# Altium project SahinbeyTeam Motor Driver.PrjPcb
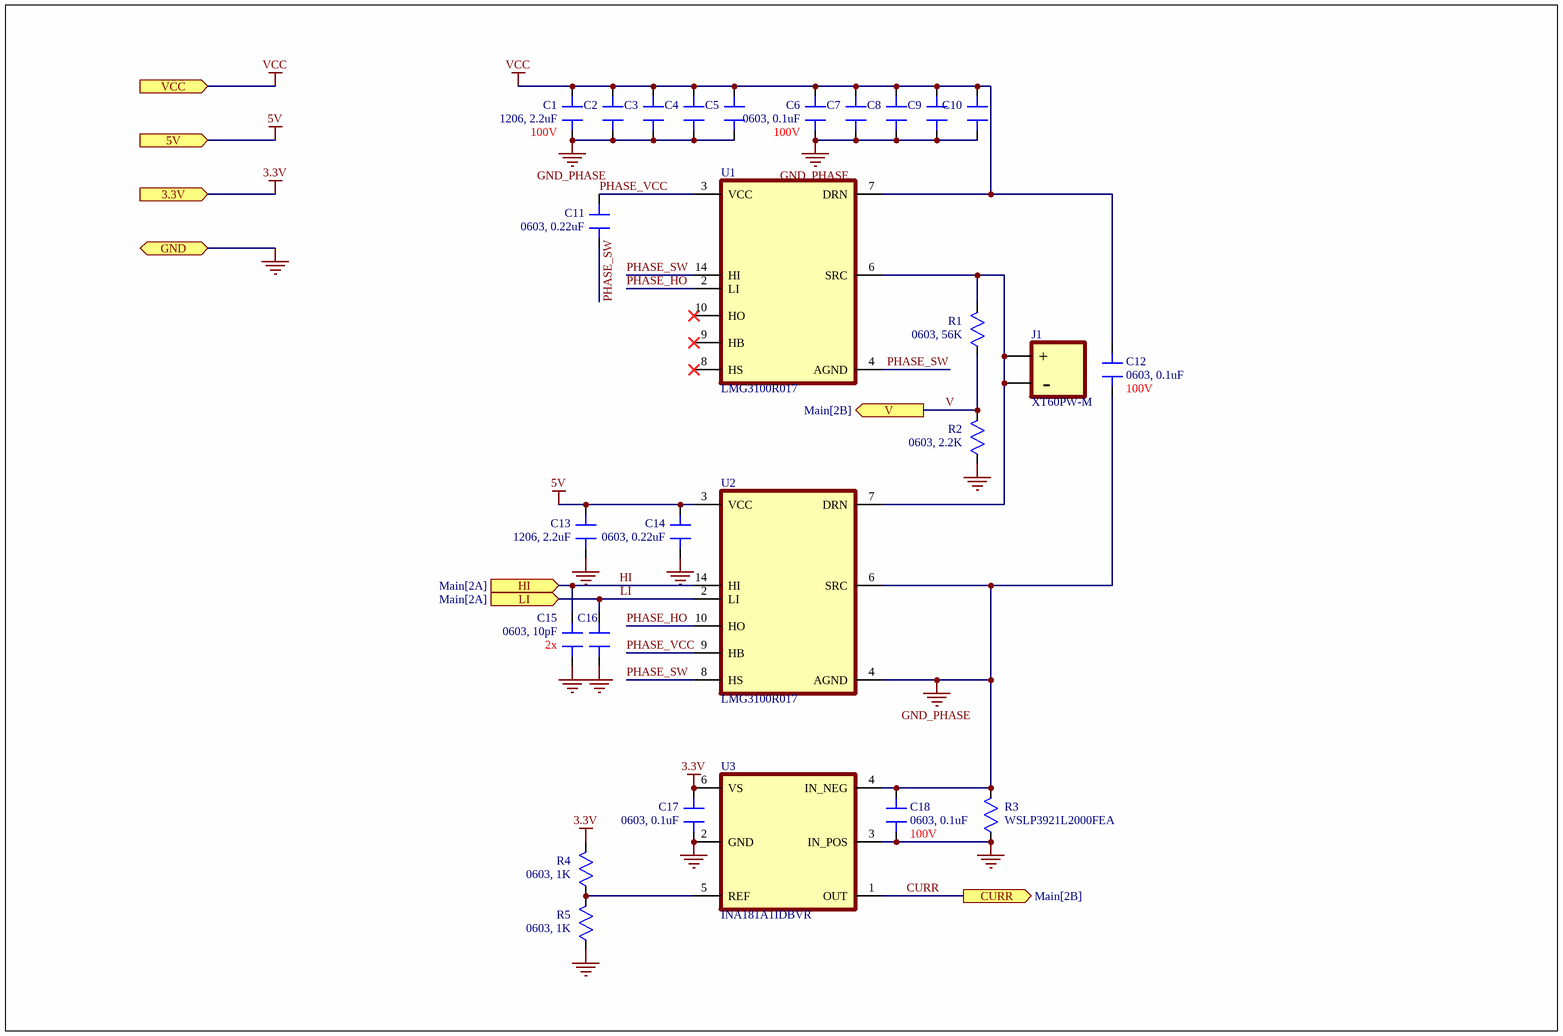
[diagram p0: Phase.SchDoc]
3 sheets, 132 parts. Net scope: flat (ports and power ports of the same name join across sheets).
Board file: SahinbeyTeam-Motor-DriverV1.0.PcbDoc
Sheets:
  Phase.SchDoc
  Power.SchDoc
  Main.SchDoc

## Sheet Phase.SchDoc
size A4; SheetNumber: 2; SheetTotal: 3

### Parts
C1  1206, 2.2uF  Voltage Rating: 100V  [CAP 1206_3216]
C2  1206, 2.2uF  [CAP 1206_3216]  (value not drawn)
C3  1206, 2.2uF  [CAP 1206_3216]  (value not drawn)
C4  1206, 2.2uF  [CAP 1206_3216]  (value not drawn)
C5  1206, 2.2uF  [CAP 1206_3216]  (value not drawn)
C6  0603, 0.1uF  Voltage Rating: 100V  [CAP 0603_1608]
C7  0603, 0.1uF  [CAP 0603_1608]  (value not drawn)
C8  0603, 0.1uF  [CAP 0603_1608]  (value not drawn)
C9  0603, 0.1uF  [CAP 0603_1608]  (value not drawn)
C10  0603, 0.1uF  [CAP 0603_1608]  (value not drawn)
C11  0603, 0.22uF  [CAP 0603_1608]
C12  0603, 0.1uF  Voltage Rating: 100V  [CAP 0603_1608]
C13  1206, 2.2uF  [CAP 1206_3216]
C14  0603, 0.22uF  [CAP 0603_1608]
C15  0603, 10pF  [CAP 0603_1608]
C16  0603, 10pF  [CAP 0603_1608]  (value not drawn)
C17  0603, 0.1uF  [CAP 0603_1608]
C18  0603, 0.1uF  Voltage Rating: 100V  [CAP 0603_1608]
J1  XT60PW-M  [XT60PW-M]
R1  0603, 56K  [RES 0603_1608]
R2  0603, 2.2K  [RES 0603_1608]
R3  WSLP3921L2000FEA  [WSLP3921L2000FEA]
R4  0603, 1K  [RES 0603_1608]
R5  0603, 1K  [RES 0603_1608]
U1  LMG3100R017  [LMG3100R017]
U2  LMG3100R017  [LMG3100R017]
U3  INA181A1IDBVR  [INA181A1IDBVR]

### Ports
3.3V (in, see Main[2A], Power[1C]), 5V (in, see Main[2A], Power[1C]), CURR (out, see Main[2B]), GND (bidir, see Main[2A], Power[1C]), HI (in, see Main[2A]), LI (in, see Main[2A]), V (out, see Main[2B]), VCC (in, see Main[2A], Power[1C])

### Nets
3.3V: C17.2 R4.2 U3.6(VS) ; port 3.3V
5V: C13.2 C14.2 U2.3(VCC) ; port 5V
GND: C13.1 C14.1 C15.1 C16.1 C17.1 C18.1 R2.1 R3.1 R5.1 U3.2(GND) U3.3(IN_POS) ; port GND
GND_PHASE: C1.1 C2.1 C3.1 C4.1 C5.1 C6.1 C7.1 C8.1 C9.1 C10.1 C12.1 C18.2 R3.2 U2.4(AGND) U2.6(SRC) U3.4(IN_NEG)
VCC: C1.2 C2.2 C3.2 C4.2 C5.2 C6.2 C7.2 C8.2 C9.2 C10.2 C12.2 U1.7(DRN) ; port VCC
CURR: U3.1(OUT) ; port CURR
HI: C15.2 U2.14(HI) ; port HI
LI: C16.2 U2.2(LI) ; port LI
PHASE_HO: U1.2(LI) U2.10(HO)
PHASE_SW: C11.1 U1.4(AGND) U1.14(HI) U2.8(HS)
PHASE_VCC: C11.2 U1.3(VCC) U2.9(HB)
V: R1.1 R2.2 ; port V
NetJ1_1: J1.1(+) J1.2(-) R1.2 U1.6(SRC) U2.7(DRN)
NetR4_1: R4.1 R5.2 U3.5(REF)

Not connected (* = marked no-connect by the designer): U1 8(HS)* 9(HB)* 10(HO)*

### Notes on the sheet
- (near C15) 2x

### Library data of the parts
C1 = 1206 Kapasitör
C2-C5 C13 = 1206 Kapasitör: Voltage Rating: 100V
C6 C11 C12 C14-C16 C18 = 0603 Kapasitör
C7-C10 C17 = 0603 Kapasitör: Voltage Rating: 100V
R1 R2 R4 R5 = 0603 Direnç

## Sheet Power.SchDoc
size A4; SheetNumber: 3; SheetTotal: 3
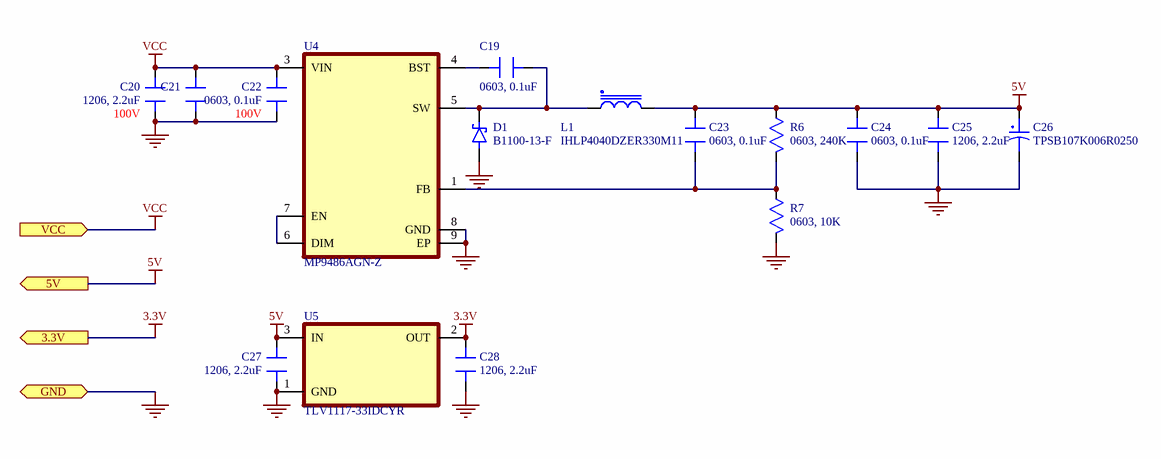
[diagram p1: Power.SchDoc]

### Parts
C19  0603, 0.1uF  [CAP 0603_1608]
C20  1206, 2.2uF  Voltage Rating: 100V  [CAP 1206_3216]
C21  1206, 2.2uF  [CAP 1206_3216]  (value not drawn)
C22  0603, 0.1uF  Voltage Rating: 100V  [CAP 0603_1608]
C23  0603, 0.1uF  [CAP 0603_1608]
C24  0603, 0.1uF  [CAP 0603_1608]
C25  1206, 2.2uF  [CAP 1206_3216]
C26  TPSB107K006R0250  [TPSB107K006R0250]
C27  1206, 2.2uF  [CAP 1206_3216]
C28  1206, 2.2uF  [CAP 1206_3216]
D1  B1100-13-F  [B1100-13-F]
L1  IHLP4040DZER330M11  [IHLP4040DZER330M11]
R6  0603, 240K  [RES 0603_1608]
R7  0603, 10K  [RES 0603_1608]
U4  MP9486AGN-Z  [MP9486AGN-Z]
U5  TLV1117-33IDCYR  [TLV1117-33IDCYR]

### Ports
3.3V (out, see Main[1B], Phase[1A]), 5V (out, see Main[1B], Phase[1A]), GND (bidir, see Main[1B], Phase[1A]), VCC (in, see Main[1B], Phase[1A])

### Nets
3.3V: C28.2 U5.2(OUT) ; port 3.3V
5V: C23.1 C24.1 C25.2 C26.1 C27.2 L1.2 R6.2 U5.3(IN) ; port 5V
GND: C20.1 C21.1 C22.1 C24.2 C25.1 C26.2 C27.1 C28.1 D1.A R7.1 U4.8(GND) U4.9(EP) U5.1(GND) ; port GND
VCC: C20.2 C21.2 C22.2 U4.3(VIN) ; port VCC
NetC19_1: C19.1 D1.C L1.1 U4.5(SW)
NetC19_2: C19.2 U4.4(BST)
NetC23_2: C23.2 R6.1 R7.2 U4.1(FB)
NetU4_6: U4.6(DIM) U4.7(EN)

### Library data of the parts
C19 C23 C24 = 0603 Kapasitör: Voltage Rating: 100V
C20 = 1206 Kapasitör
C21 C25 C27 C28 = 1206 Kapasitör: Voltage Rating: 100V
C22 = 0603 Kapasitör
R6 R7 = 0603 Direnç

## Sheet Main.SchDoc
size A4; SheetNumber: 1; SheetTotal: 1
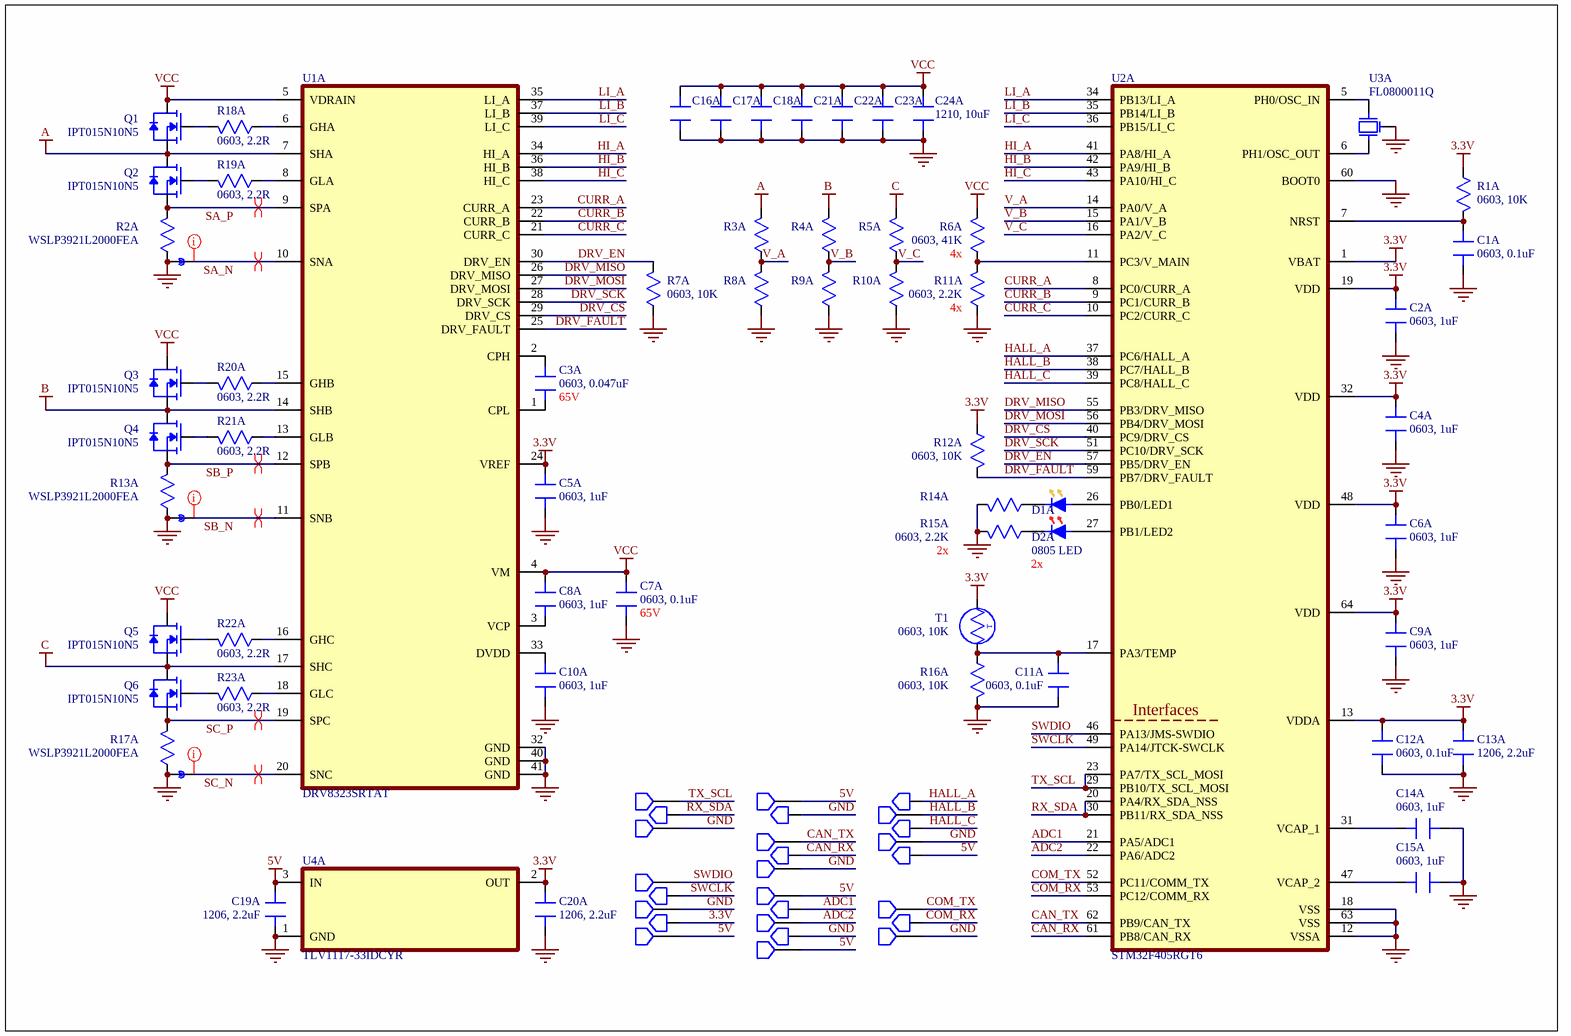
[diagram p2: Main.SchDoc]

### Parts
*1  NetTie  [NETTİE]  (value not drawn)  (no BOM)
*2  NetTie  [NETTİE]  (value not drawn)  (no BOM)
*3  NetTie  [NETTİE]  (value not drawn)  (no BOM)
C1A  0603, 0.1uF  [CAP 0603_1608]
C2A  0603, 1uF  [CAP 0603_1608]
C3A  0603, 0.047uF  [CAP 0603_1608]
C4A  0603, 1uF  [CAP 0603_1608]
C5A  0603, 1uF  [CAP 0603_1608]
C6A  0603, 1uF  [CAP 0603_1608]
C7A  0603, 0.1uF  [CAP 0603_1608]
C8A  0603, 1uF  [CAP 0603_1608]
C9A  0603, 1uF  [CAP 0603_1608]
C10A  0603, 1uF  [CAP 0603_1608]
C11A  0603, 0.1uF  [CAP 0603_1608]
C12A  0603, 0.1uF  [CAP 0603_1608]
C13A  1206, 2.2uF  [CAP 1206_3216]
C14A  0603, 1uF  [CAP 0603_1608]
C15A  0603, 1uF  [CAP 0603_1608]
C16A  1210, 10uF  [CAP 1210_3225 - 2.5MM]  (value not drawn)
C17A  1210, 10uF  [CAP 1210_3225 - 2.5MM]  (value not drawn)
C18A  1210, 10uF  [CAP 1210_3225 - 2.5MM]  (value not drawn)
C19A  1206, 2.2uF  [CAP 1206_3216]
C20A  1206, 2.2uF  [CAP 1206_3216]
C21A  1210, 10uF  [CAP 1210_3225 - 2.5MM]  (value not drawn)
C22A  1210, 10uF  [CAP 1210_3225 - 2.5MM]  (value not drawn)
C23A  1210, 10uF  [CAP 1210_3225 - 2.5MM]  (value not drawn)
C24A  1210, 10uF  [CAP 1210_3225 - 2.5MM]
D1A  0805 LED Yellow  [LED 0805_2012 YELLOW]  (value not drawn)
D2A  0805 LED Red  [LED 0805_2012 RED]  (value not drawn)
P1  Pad1  [PAD]  (value not drawn)  (no BOM)
P2  Pad1  [PAD]  (value not drawn)  (no BOM)
P4  Pad0  [PAD]  (value not drawn)  (no BOM)
P5  Pad0  [PAD]  (value not drawn)  (no BOM)
P6  Pad0  [PAD]  (value not drawn)  (no BOM)
P7  Pad1  [PAD]  (value not drawn)  (no BOM)
P8  Pad1  [PAD]  (value not drawn)  (no BOM)
P9  Pad1  [PAD]  (value not drawn)  (no BOM)
P10  Pad0  [PAD]  (value not drawn)  (no BOM)
P11  Pad0  [PAD]  (value not drawn)  (no BOM)
P12  Pad1  [PAD]  (value not drawn)  (no BOM)
P13  Pad1  [PAD]  (value not drawn)  (no BOM)
P14  Pad0  [PAD]  (value not drawn)  (no BOM)
P15  Pad1  [PAD]  (value not drawn)  (no BOM)
P16  Pad0  [PAD]  (value not drawn)  (no BOM)
P17  Pad0  [PAD]  (value not drawn)  (no BOM)
P18  Pad1  [PAD]  (value not drawn)  (no BOM)
P19  Pad1  [PAD]  (value not drawn)  (no BOM)
P20  Pad1  [PAD]  (value not drawn)  (no BOM)
P21  Pad0  [PAD]  (value not drawn)  (no BOM)
P22  Pad0  [PAD]  (value not drawn)  (no BOM)
P23  Pad0  [PAD]  (value not drawn)  (no BOM)
P24  Pad1  [PAD]  (value not drawn)  (no BOM)
P25  Pad1  [PAD]  (value not drawn)  (no BOM)
P26  Pad1  [PAD]  (value not drawn)  (no BOM)
P27  Pad1  [PAD]  (value not drawn)  (no BOM)
Q1  IPT015N10N5  [IPT015N10N5]
Q2  IPT015N10N5  [IPT015N10N5]
Q3  IPT015N10N5  [IPT015N10N5]
Q4  IPT015N10N5  [IPT015N10N5]
Q5  IPT015N10N5  [IPT015N10N5]
Q6  IPT015N10N5  [IPT015N10N5]
R1A  0603, 10K  [RES 0603_1608]
R2A  WSLP3921L2000FEA  [WSLP3921L2000FEA]
R3A  0603, 41K  [RES 0603_1608]  (value not drawn)
R4A  0603, 41K  [RES 0603_1608]  (value not drawn)
R5A  0603, 41K  [RES 0603_1608]  (value not drawn)
R6A  0603, 41K  [RES 0603_1608]
R7A  0603, 10K  [RES 0603_1608]
R8A  0603, 2.2K  [RES 0603_1608]  (value not drawn)
R9A  0603, 2.2K  [RES 0603_1608]  (value not drawn)
R10A  0603, 2.2K  [RES 0603_1608]  (value not drawn)
R11A  0603, 2.2K  [RES 0603_1608]
R12A  0603, 10K  [RES 0603_1608]
R13A  WSLP3921L2000FEA  [WSLP3921L2000FEA]
R14A  0603, 2.2K  [RES 0603_1608]  (value not drawn)
R15A  0603, 2.2K  [RES 0603_1608]
R16A  0603, 10K  [RES 0603_1608]
R17A  WSLP3921L2000FEA  [WSLP3921L2000FEA]
R18A  0603, 2.2R  [RES 0603_1608]
R19A  0603, 2.2R  [RES 0603_1608]
R20A  0603, 2.2R  [RES 0603_1608]
R21A  0603, 2.2R  [RES 0603_1608]
R22A  0603, 2.2R  [RES 0603_1608]
R23A  0603, 2.2R  [RES 0603_1608]
T1  0603, 10K  [RES 0603_1608]
U1A  DRV8323SRTAT  [DRV8323SRTAT]
U2A  STM32F405RGT6  [STM32F405RGT6]
U3A  FL0800011Q  [FL0800011Q]
U4A  TLV1117-33IDCYR  [TLV1117-33IDCYR]

### Nets
3.3V: C2A.1 C4A.1 C5A.1 C6A.1 C9A.1 C12A.1 C13A.2 C20A.2 P21.1 R1A.2 R12A.2 T1.2 U1A.24(VREF) U2A.1(VBAT) U2A.13(VDDA) U2A.19(VDD) U2A.32(VDD) U2A.48(VDD) U2A.64(VDD) U4A.2(OUT)
5V: C19A.2 P2.1 P14.1 P24.1 P25.1 P27.1 U4A.3(IN)
A: Q1.S1(S) Q2.TAP(D) R3A.2 U1A.7(SHA)
B: Q3.S1(S) Q4.TAP(D) R4A.2 U1A.14(SHB)
C: Q5.S1(S) Q6.TAP(D) R5A.2 U1A.17(SHC)
GND: *1.0 *2.0 *3.0 C1A.2 C2A.2 C4A.2 C5A.2 C6A.2 C7A.2 C9A.2 C10A.2 C11A.2 C12A.2 C13A.1 C14A.1 C15A.1 C16A.1 C17A.1 C18A.1 C19A.1 C20A.1 C21A.1 C22A.1 C23A.1 C24A.1 P5.1 P7.1 P12.1 P13.1 P18.1 P22.1 P26.1 R2A.1 R7A.1 R8A.1 R9A.1 R10A.1 R11A.1 R13A.1 R14A.2 R15A.2 R16A.1 R17A.1 U1A.32(GND) U1A.40(GND) U1A.41(GND) U2A.12(VSSA) U2A.18(VSS) U2A.60(BOOT0) U2A.63(VSS) U3A.4(GND) U4A.1(GND)
VCC: C7A.1 C8A.1 C16A.2 C17A.2 C18A.2 C21A.2 C22A.2 C23A.2 C24A.2 Q1.TAP(D) Q3.TAP(D) Q5.TAP(D) R6A.2 U1A.4(VM) U1A.5(VDRAIN)
ADC1: P17.1 U2A.21(PA5/ADC1)
ADC2: P19.1 U2A.22(PA6/ADC2)
CAN_RX: P11.1 U2A.61(PB8/CAN_RX)
CAN_TX: P9.1 U2A.62(PB9/CAN_TX)
COM_RX: P23.1 U2A.53(PC12/COMM_RX)
COM_TX: P20.1 U2A.52(PC11/COMM_TX)
CURR_A: U1A.23(CURR_A) U2A.8(PC0/CURR_A)
CURR_B: U1A.22(CURR_B) U2A.9(PC1/CURR_B)
CURR_C: U1A.21(CURR_C) U2A.10(PC2/CURR_C)
DRV_CS: U1A.29(DRV_CS) U2A.40(PC9/DRV_CS)
DRV_EN: R7A.2 U1A.30(DRV_EN) U2A.57(PB5/DRV_EN)
DRV_FAULT: R12A.1 U1A.25(DRV_FAULT) U2A.59(PB7/DRV_FAULT)
DRV_MISO: U1A.26(DRV_MISO) U2A.55(PB3/DRV_MISO)
DRV_MOSI: U1A.27(DRV_MOSI) U2A.56(PB4/DRV_MOSI)
DRV_SCK: U1A.28(DRV_SCK) U2A.51(PC10/DRV_SCK)
HALL_A: P6.1 U2A.37(PC6/HALL_A)
HALL_B: P8.1 U2A.38(PC7/HALL_B)
HALL_C: P10.1 U2A.39(PC8/HALL_C)
HI_A: U1A.34(HI_A) U2A.41(PA8/HI_A)
HI_B: U1A.36(HI_B) U2A.42(PA9/HI_B)
HI_C: U1A.38(HI_C) U2A.43(PA10/HI_C)
LI_A: U1A.35(LI_A) U2A.34(PB13/LI_A)
LI_B: U1A.37(LI_B) U2A.35(PB14/LI_B)
LI_C: U1A.39(LI_C) U2A.36(PB15/LI_C)
RX_SDA: P4.1 U2A.20(PA4/RX_SDA_NSS) U2A.30(PB11/RX_SDA_NSS)
SA_N: *1.1 U1A.10(SNA)
SA_P: Q2.S1(S) R2A.2 U1A.9(SPA)
SB_N: *2.1 U1A.11(SNB)
SB_P: Q4.S1(S) R13A.2 U1A.12(SPB)
SC_N: *3.1 U1A.20(SNC)
SC_P: Q6.S1(S) R17A.2 U1A.19(SPC)
SWCLK: P16.1 U2A.49(PA14/JTCK-SWCLK)
SWDIO: P15.1 U2A.46(PA13/JMS-SWDIO)
TX_SCL: P1.1 U2A.23(PA7/TX_SCL_MOSI) U2A.29(PB10/TX_SCL_MOSI)
V_A: R3A.1 R8A.2 U2A.14(PA0/V_A)
V_B: R4A.1 R9A.2 U2A.15(PA1/V_B)
V_C: R5A.1 R10A.2 U2A.16(PA2/V_C)
NetC1A_1: C1A.1 R1A.1 U2A.7(NRST)
NetC3A_1: C3A.1 U1A.2(CPH)
NetC3A_2: C3A.2 U1A.1(CPL)
NetC8A_2: C8A.2 U1A.3(VCP)
NetC10A_1: C10A.1 U1A.33(DVDD)
NetC11A_1: C11A.1 R16A.2 T1.1 U2A.17(PA3/TEMP)
NetC14A_2: C14A.2 U2A.31(VCAP_1)
NetC15A_2: C15A.2 U2A.47(VCAP_2)
NetD1A_1: D1A.1 U2A.26(PB0/LED1)
NetD1A_2: D1A.2 R14A.1
NetD2A_1: D2A.1 U2A.27(PB1/LED2)
NetD2A_2: D2A.2 R15A.1
NetQ1_G: Q1.G R18A.2
NetQ2_G: Q2.G R19A.2
NetQ3_G: Q3.G R20A.2
NetQ4_G: Q4.G R21A.2
NetQ5_G: Q5.G R22A.2
NetQ6_G: Q6.G R23A.2
NetR6A_1: R6A.1 R11A.2 U2A.11(PC3/V_MAIN)
NetR18A_1: R18A.1 U1A.6(GHA)
NetR19A_1: R19A.1 U1A.8(GLA)
NetR20A_1: R20A.1 U1A.15(GHB)
NetR21A_1: R21A.1 U1A.13(GLB)
NetR22A_1: R22A.1 U1A.16(GHC)
NetR23A_1: R23A.1 U1A.18(GLC)
NetU2A_5: U2A.5(PH0/OSC_IN) U3A.3
NetU2A_6: U2A.6(PH1/OSC_OUT) U3A.1

### Layout directives
differential pair: SA_N, SA_P, SB_N, SB_P, SC_N, SC_P
net class ShuntNet: SA_N, SB_N, SC_N

### Notes on the sheet
- (near R11A) 4x
- 4x
- (near C3A) 65V
- 2x
- 0805 LED
- (near C7A) 65V
- (near T1) T
- (in symbol STM32F405RGT6) Interfaces

### Library data of the parts
C1A C3A C7A C11A C12A = 0603 Kapasitör: Voltage Rating: 100V
C2A C4A C5A C6A C8A C9A C10A C14A C15A = 0603 Kapasitör
C13A C19A C20A = 1206 Kapasitör: Voltage Rating: 100V
C16A C17A C18A C21A C22A C23A C24A = 1210 Kapasitör
R1A R3A R4A R5A R6A R7A R8A R9A R10A R11A R12A R14A R15A R16A R18A R19A R20A R21A R22A R23A T1 = 0603 Direnç

## Nets that join several sheets
3.3V: Phase (C17.2 R4.2 U3.6), Power (C28.2 U5.2), Main (20 pins)
5V: Phase (C13.2 C14.2 U2.3), Power (8 pins), Main (7 pins)
GND: Phase (11 pins), Power (13 pins), Main (52 pins)
VCC: Phase (12 pins), Power (C20.2 C21.2 C22.2 U4.3), Main (15 pins)